# EAGLE design LED matrix (EAGLE 5.06)
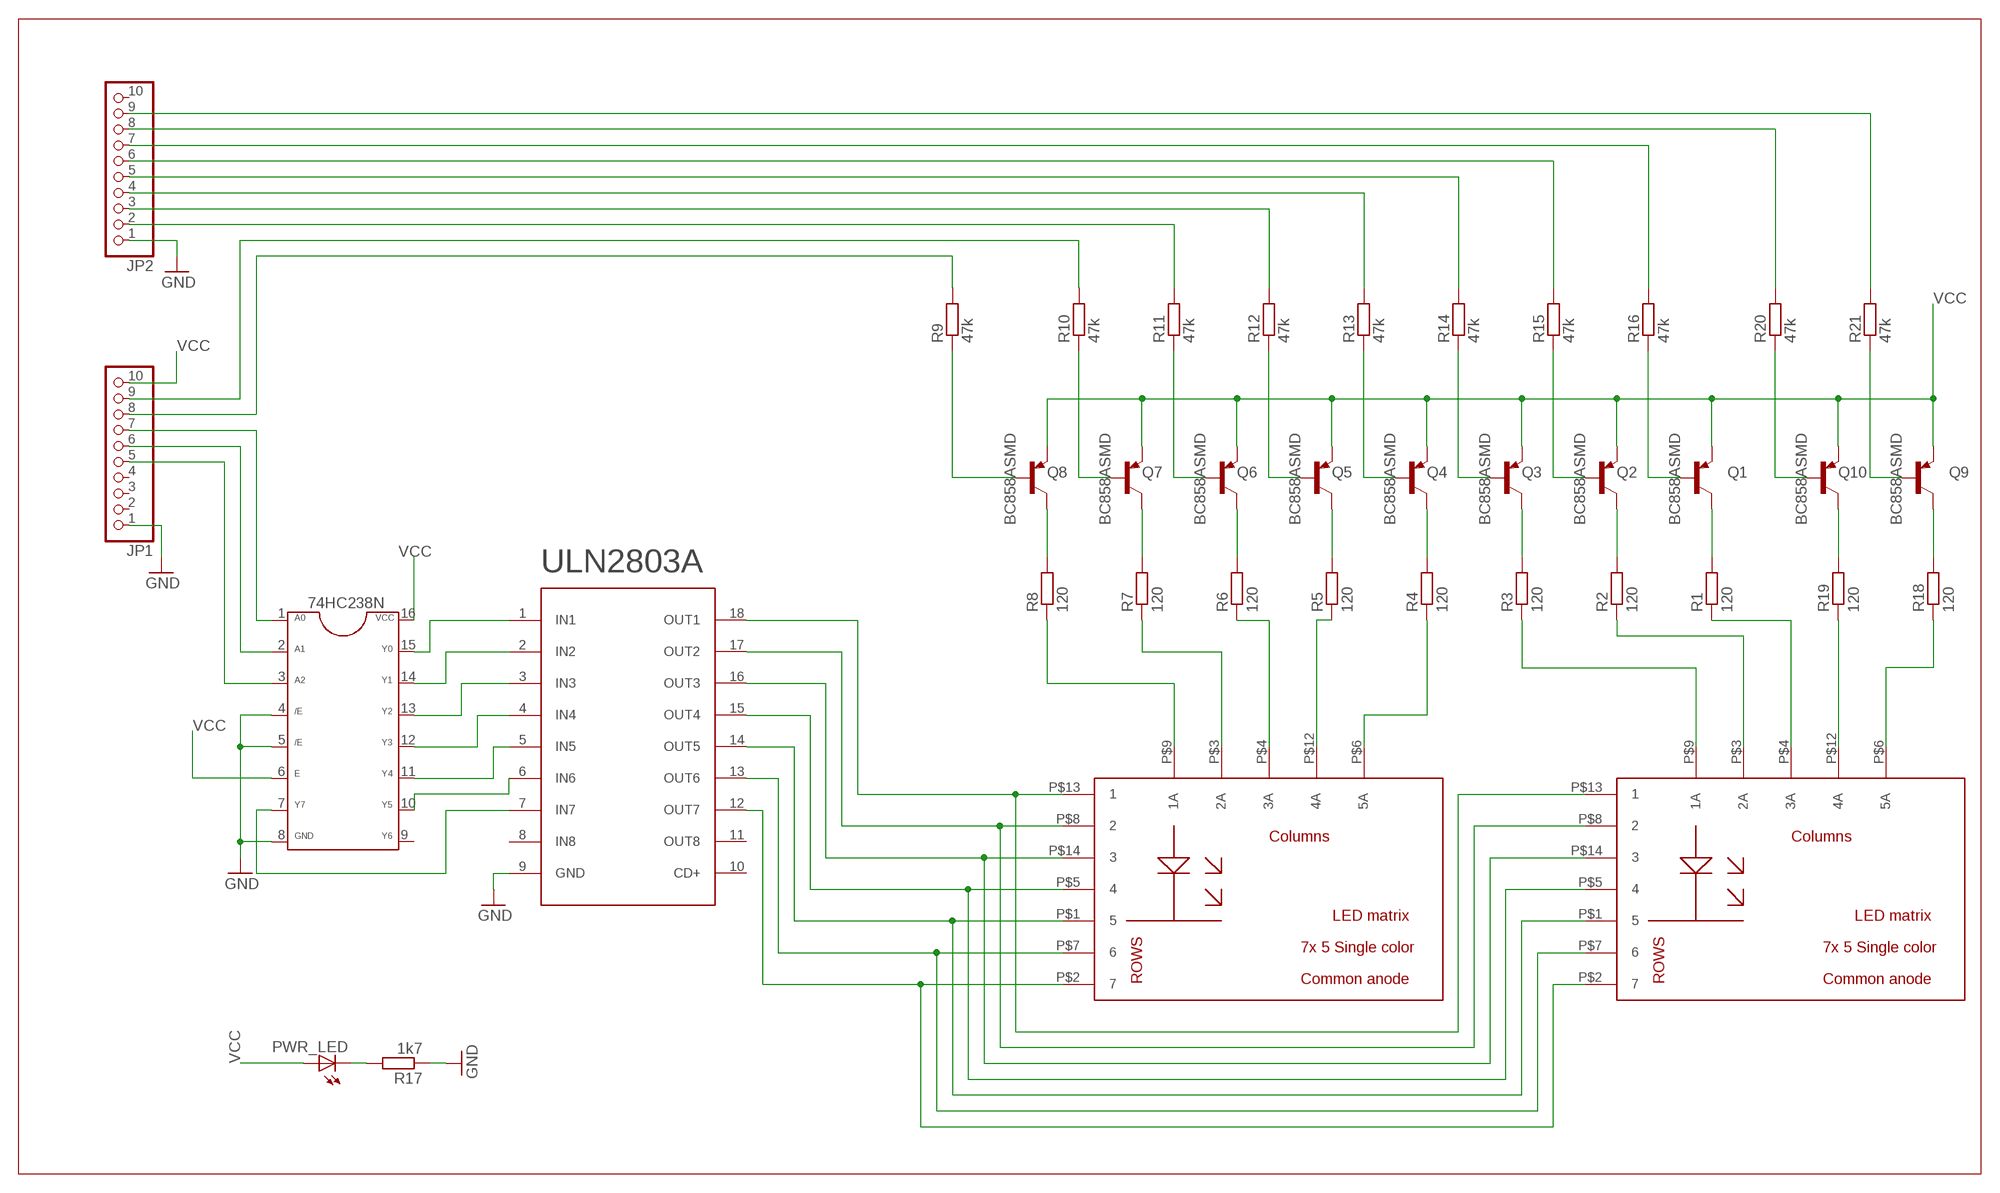
[diagram p0: schematic, sheet 1]

## Parts
74HC238N  DIL16  [DIL16]
JP1  PINHD-1X10_2.54-90°  [1X10/90]
JP2  PINHD-1X10_2.54-90°  [1X10/90]
PWR_LED  LED3MM  [LED3MM]
Q1  BC858ASMD  [SOT23-BEC]
Q2  BC858ASMD  [SOT23-BEC]
Q3  BC858ASMD  [SOT23-BEC]
Q4  BC858ASMD  [SOT23-BEC]
Q5  BC858ASMD  [SOT23-BEC]
Q6  BC858ASMD  [SOT23-BEC]
Q7  BC858ASMD  [SOT23-BEC]
Q8  BC858ASMD  [SOT23-BEC]
Q9  BC858ASMD  [SOT23-BEC]
Q10  BC858ASMD  [SOT23-BEC]
R1  120  R-EU_R1206  [R1206]
R2  120  R-EU_R1206  [R1206]
R3  120  R-EU_R1206  [R1206]
R4  120  R-EU_R1206  [R1206]
R5  120  R-EU_R1206  [R1206]
R6  120  R-EU_R1206  [R1206]
R7  120  R-EU_R1206  [R1206]
R8  120  R-EU_R1206  [R1206]
R9  47k  R-EU_R1206  [R1206]
R10  47k  R-EU_R1206  [R1206]
R11  47k  R-EU_R1206  [R1206]
R12  47k  R-EU_R1206  [R1206]
R13  47k  R-EU_R1206  [R1206]
R14  47k  R-EU_R1206  [R1206]
R15  47k  R-EU_R1206  [R1206]
R16  47k  R-EU_R1206  [R1206]
R17  1k7  R-EU_R1206  [R1206]
R18  120  R-EU_R1206  [R1206]
R19  120  R-EU_R1206  [R1206]
R20  47k  R-EU_R1206  [R1206]
R21  47k  R-EU_R1206  [R1206]
U$1  LED_MATRIX_7X5  [LED_MATRIX_8X8_SINGLE_COLOR]
U$2  LED_MATRIX_7X5  [LED_MATRIX_8X8_SINGLE_COLOR]
ULN2803A  ULN2803A  [DIL18]

## Nets
1: JP1.8 R9.2
2: JP1.9 R10.2
3: JP2.2 R11.2
4: JP2.3 R12.2
5: JP2.4 R13.2
6: JP2.5 R14.2
7: JP2.6 R15.2
8: JP2.7 R16.2
9: JP2.8 R20.2
10: JP2.9 R21.2
GND: 74HC238N.4 74HC238N.5 74HC238N.8 JP1.1 JP2.1 R17.1 ULN2803A.9(GND)
N$1: Q8.B R9.1
N$2: Q7.B R10.1
N$3: Q6.B R11.1
N$4: Q5.B R12.1
N$5: Q4.B R13.1
N$6: Q3.B R14.1
N$7: Q2.B R15.1
N$8: Q1.B R16.1
N$9: Q8.C R8.2
N$10: Q7.C R7.2
N$11: Q6.C R6.2
N$12: Q5.C R5.2
N$13: Q4.C R4.2
N$14: Q3.C R3.2
N$15: Q2.C R2.2
N$16: Q1.C R1.2
N$17: PWR_LED.K(C) R17.2
N$18: Q10.B R20.1
N$19: Q9.B R21.1
N$20: Q10.C R19.2
N$21: Q9.C R18.2
N$22: R18.1 U$2.P$6(5A)
N$23: R19.1 U$2.P$12(4A)
N$24: R1.1 U$2.P$4(3A)
N$25: U$1.P$5 U$2.P$5 ULN2803A.15(OUT4)
N$26: U$1.P$13 U$2.P$13 ULN2803A.18(OUT1)
N$27: R2.1 U$2.P$3(2A)
N$28: R3.1 U$2.P$9(1A)
N$29: U$1.P$14 U$2.P$14 ULN2803A.16(OUT3)
N$30: U$1.P$8 U$2.P$8 ULN2803A.17(OUT2)
N$31: R4.1 U$1.P$6(5A)
N$32: R5.1 U$1.P$12(4A)
N$33: R6.1 U$1.P$4(3A)
N$34: R7.1 U$1.P$3(2A)
N$35: R8.1 U$1.P$9(1A)
N$36: 74HC238N.1 JP1.7
N$37: 74HC238N.2 JP1.6
N$38: 74HC238N.3 JP1.5
N$39: 74HC238N.15 ULN2803A.1(IN1)
N$40: 74HC238N.14 ULN2803A.2(IN2)
N$41: U$1.P$1 U$2.P$1 ULN2803A.14(OUT5)
N$42: U$1.P$7 U$2.P$7 ULN2803A.13(OUT6)
N$43: U$1.P$2 U$2.P$2 ULN2803A.12(OUT7)
N$44: 74HC238N.13 ULN2803A.3(IN3)
N$45: 74HC238N.12 ULN2803A.4(IN4)
N$46: 74HC238N.11 ULN2803A.5(IN5)
N$47: 74HC238N.10 ULN2803A.6(IN6)
N$48: 74HC238N.7 ULN2803A.7(IN7)
VCC: 74HC238N.6 74HC238N.16 JP1.10 PWR_LED.A Q1.E Q2.E Q3.E Q4.E Q5.E Q6.E Q7.E Q8.E Q9.E Q10.E
Unconnected: 74HC238N.9 JP1.2 JP1.3 JP1.4 JP2.10 ULN2803A.8(IN8) ULN2803A.10(CD+) ULN2803A.11(OUT8)

## Library data of the parts
74HC238N = at90,:DIL16: Dual In Line / Socket
JP1 JP2 = acon-tyco (19):PINHD-1X10: PIN HEADER
PWR_LED = led:LED: LED OSRAM: - CHIPLED LG R971, LG N971, LY N971, LG Q971, LY Q971, LO R971, LY R971 LH N974, LH R974 LS Q976, LO Q976, LY Q976 LO Q996 - Hyper CHIPLED LW Q18S LB Q993, LB Q99A, LB R99A - SideLED LS A670, LO A670, LY A670, LG A670, LP A670 LB A673, LV A673, LT A673, LW A673 LH A674 LY A675 LS A676, LA A676, LO A676, LY A676, LW A676 LS A679, LY A679, LG A679 - Hyper Micro SIDELED® LS Y876, LA Y876, LO Y876, LY Y876 LT Y87S - SmartLED LW L88C, LW L88S LB L89C, LB L89S, LG L890 LS L89K, LO L89K, LY L89K LS L896, LA L896, LO L896, LY L896 - TOPLED LS T670, LO T670, LY T670, LG T670, LP T670 LSG T670, LSP T670, LSY T670, LOP T670, LYG T670 LG T671, LOG T671, LSG T671 LB T673, LV T673, LT T673, LW T673 LH T674 LS T676, LA T676, LO T676, LY T676, LB T676, LH T676, LSB T676, LW T676 LB T67C, LV T67C, LT T67C, LS T67K, LO T67K, LY T67K, LW E67C LS E67B, LA E67B, LO E67B, LY E67B, LB E67C, LV E67C, LT E67C LW T67C LS T679, LY T679, LG T679 LS T770, LO T770, LY T770, LG T770, LP T770 LB T773, LV T773, LT T773, LW T773 LH T774 LS E675, LA E675, LY E675, LS T675 LS T776, LA T776, LO T776, LY T776, LB T776 LHGB T686 LT T68C, LB T68C - Hyper Mini TOPLED® LB M676 - Mini TOPLED Santana® LG M470 LS M47K, LO M47K, LY M47K Source: http://www.osram.convergy.de LUXEON: - LUMILED® LXK2-PW12-R00, LXK2-PW12-S00, LXK2-PW14-U00, LXK2-PW14-V00 LXK2-PM12-R00, LXK2-PM12-S00, LXK2-PM14-U00 LXK2-PE12-Q00, LXK2-PE12-R00, LXK2-PE12-S00, LXK2-PE14-T00, LXK2-PE14-U00 LXK2-PB12-K00, LXK2-PB12-L00, LXK2-PB12-M00, LXK2-PB14-N00, LXK2-PB14-P00, LXK2-PB14-Q00 LXK2-PR12-L00, LXK2-PR12-M00, LXK2-PR14-Q00, LXK2-PR14-R00 LXK2-PD12-Q00, LXK2-PD12-R00, LXK2-PD12-S00 LXK2-PH12-R00, LXK2-PH12-S00 LXK2-PL12-P00, LXK2-PL12-Q00, LXK2-PL12-R00 Source: www.luxeon.com KINGBRIGHT: KA-3528ASYC Source: www.kingbright.com
Q1-Q10 = transistor-pnp:BC858*: PNP Transistror
R1-R21 = resistor:R-EU_: RESISTOR, European symbol
U$1 U$2 = at90,:LED_MATRIX_7X5
ULN2803A = UNdarlingtony:ULN2803A

## Board
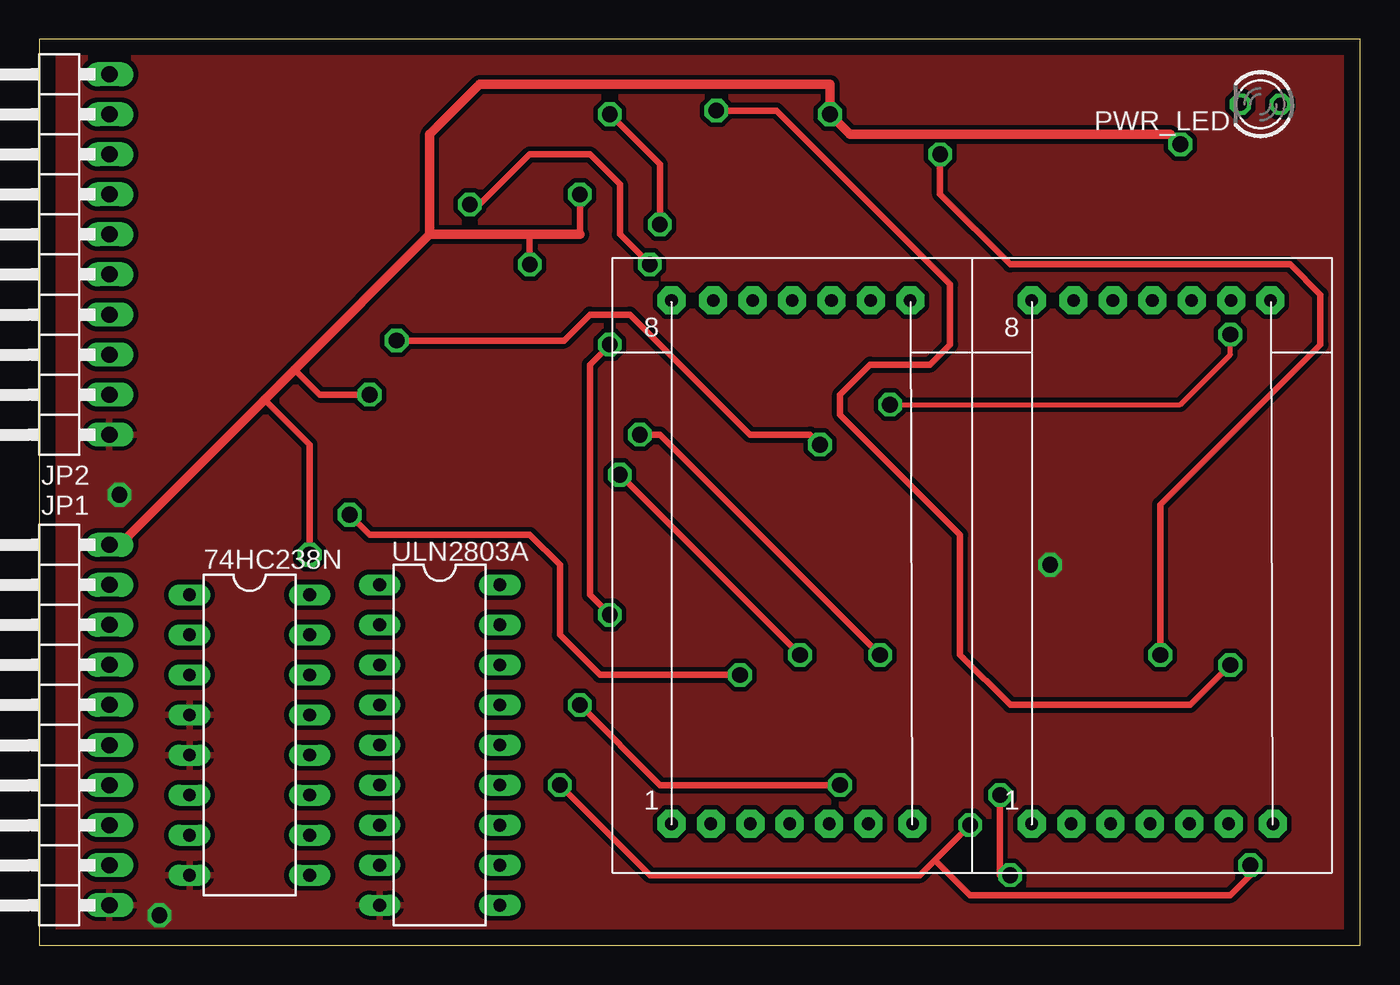
[diagram p1: board, top side]
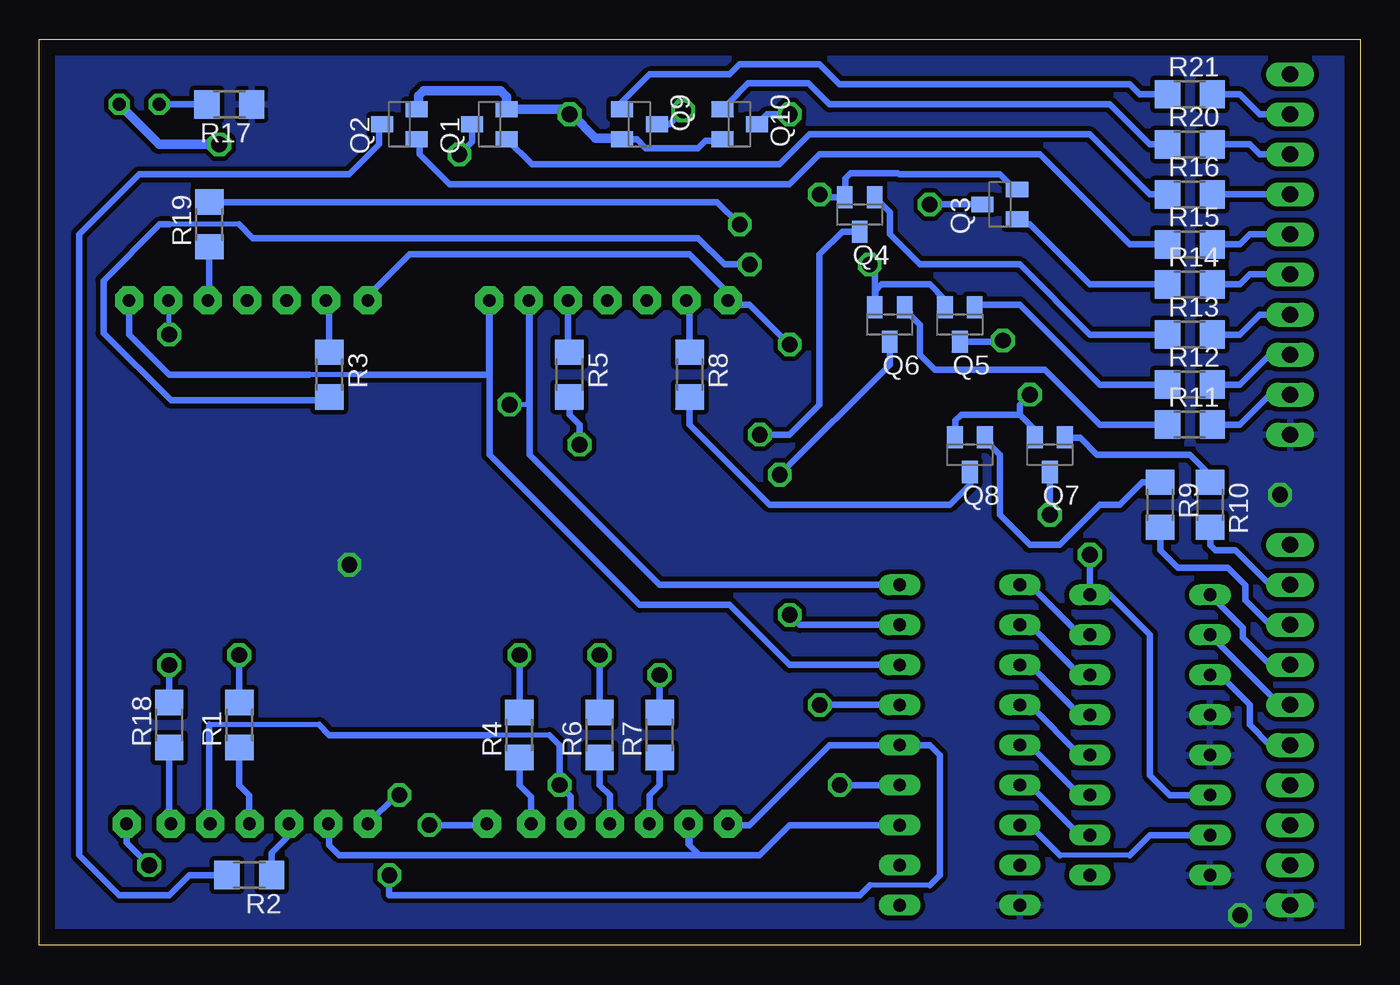
[diagram p2: board, bottom side, seen from below]

Size 83.8 x 57.45 mm. Coordinates in mm from the lower left corner, seen from the top.
Outline: 0,0 83.8,0 83.8,57.45 0,57.45 0,0
Copper layers (1*16): Top 0.035mm / dielectric 1.5mm / Bottom 0.035mm
Design rules "default *": minimum track width 10mil, minimum drill 24mil, track to track 8mil, track to pad 8mil, pad to pad 8mil, via to via 8mil, smd to smd 8mil, copper to edge 40mil, drill to drill 8mil, minimum pad ring 10mil, minimum via ring 8mil, stop-mask expansion 4mil, vias tented up to drill 0mil, thermal gap 10mil

### Footprints (pad centres in the part's own frame; a part is rotated, then mirrored left to right if it is on the bottom)
DIL16 = drill 0.813 long: 1 -8.89,-3.81; 2 -6.35,-3.81; 3 -3.81,-3.81; 4 -1.27,-3.81; 5 1.27,-3.81; 6 3.81,-3.81; 7 6.35,-3.81; 8 8.89,-3.81; 9 8.89,3.81; 10 6.35,3.81; 11 3.81,3.81; 12 1.27,3.81; 13 -1.27,3.81; 14 -3.81,3.81; 15 -6.35,3.81; 16 -8.89,3.81
1X10/90 = drill 1.016 long: 1 -11.43,-3.81; 2 -8.89,-3.81; 3 -6.35,-3.81; 4 -3.81,-3.81; 5 -1.27,-3.81; 6 1.27,-3.81; 7 3.81,-3.81; 8 6.35,-3.81; 9 8.89,-3.81; 10 11.43,-3.81
LED3MM = drill 0.813 octagon: A -1.27,0; K 1.27,0
SOT23-BEC = smd 1 x 1.4: B -0.95,-1.1; C 0,1.1; E 0.95,-1.1
R1206 = smd 1.6 x 1.803: 1 -1.422,0; 2 1.422,0
LED_MATRIX_8X8_SINGLE_COLOR = drill 0.8 pad 1.778 octagon: P$1 -6.25,-6.9; P$2 -3.75,-6.9; P$3 -1.25,-6.9; P$4 1.25,-6.9; P$5 3.75,-6.9; P$6 6.25,-6.9; P$7 9.05,-6.9; P$8 -6.25,26.3; P$9 -3.6,26.3; P$10 -1.1,26.3; P$11 1.4,26.3; P$12 3.9,26.3; P$13 6.4,26.3; P$14 8.9,26.3
DIL18 = drill 0.813 long: 1 -10.16,-3.81; 2 -7.62,-3.81; 3 -5.08,-3.81; 4 -2.54,-3.81; 5 0,-3.81; 6 2.54,-3.81; 7 5.08,-3.81; 8 7.62,-3.81; 9 10.16,-3.81; 10 10.16,3.81; 11 7.62,3.81; 12 5.08,3.81; 13 2.54,3.81; 14 0,3.81; 15 -2.54,3.81; 16 -5.08,3.81; 17 -7.62,3.81; 18 -10.16,3.81

### Placement (x,y rotation side)
74HC238N  13.34,13.34 270 top
JP1  0.64,13.97 90 top
JP2  0.64,43.81 90 top
PWR_LED  77.47,53.34 180 top
Q1  55.24,52.07 90 bottom
Q2  60.96,52.07 90 bottom
Q3  22.86,46.99 90 bottom
Q4  31.75,46.35 180 bottom
Q5  25.4,39.37 180 bottom
Q6  29.84,39.37 180 bottom
Q7  19.68,31.11 180 bottom
Q8  24.77,31.11 180 bottom
Q9  45.72,52.07 270 bottom
Q10  39.37,52.07 270 bottom
R1  71.12,13.97 90 bottom
R2  70.48,4.45 180 bottom
R3  65.41,36.2 270 bottom
R4  53.34,13.34 90 bottom
R5  50.16,36.2 270 bottom
R6  48.26,13.34 90 bottom
R7  44.45,13.34 90 bottom
R8  42.55,36.2 270 bottom
R9  12.7,27.94 270 bottom
R10  9.53,27.94 270 bottom
R11  10.79,33.02 0 bottom
R12  10.79,35.56 0 bottom
R13  10.79,38.73 0 bottom
R14  10.79,41.91 0 bottom
R15  10.79,44.45 0 bottom
R16  10.79,47.62 0 bottom
R17  71.75,53.34 180 bottom
R18  75.56,13.97 90 bottom
R19  73.03,45.72 90 bottom
R20  10.79,50.8 0 bottom
R21  10.79,53.98 0 bottom
U$1  46.35,14.61 0 top
U$2  69.22,14.61 0 top
ULN2803A  25.4,12.7 270 top

### Tracks (layer width: path | path; a pad name or v marks a point on that pad's centre or on a via)
1
  Bottom 0.406: JP1.8 5.71,20.32 6.99,21.59 7.01,21.59 7.29,21.87 7.29,22.82 8.4,23.93 11.57,23.93 12.68,25.04 12.68,26.5 R9.2
2
  Bottom 0.406: JP1.9 5.74,22.86 7.92,25.04 9.19,25.04 9.51,25.36 9.51,26.5 R10.2
3
  Bottom 0.406: JP2.2 5.71,34.92 7.62,33.02 R11.2
4
  Bottom 0.406: JP2.3 5.71,37.47 7.62,35.56 R12.2
5
  Bottom 0.406: JP2.4 6.35,40.01 7.62,38.73 R13.2
6
  Bottom 0.406: JP2.5 6.99,42.55 7.62,41.91 R14.2
7
  Bottom 0.406: JP2.6 6.99,45.09 7.62,44.45 R15.2
8
  Bottom 0.406: JP2.7 R16.2
9
  Bottom 0.406: JP2.8 6.35,50.16 6.99,50.8 R20.2
10
  Bottom 0.406: JP2.9 6.35,52.7 7.62,53.98 R21.2
GND  (via drill 1)
  other vias: 7.62,1.91 5.08,28.57 64.14,24.13
  pour Bottom (isolate 0.305): -8.89,-5.08 90.17,-5.08 90.17,63.5 -8.89,63.5
  pour Top (isolate 0.305): -6.35,-2.54 87,-2.54 87,60.96 -6.35,60.96
N$1
  Bottom 0.406: Q8.B 23.46,31.86 23.46,31.7 22.86,31.1 22.86,27.3 20.95,25.4 19.05,25.4 16.51,27.94 15.24,27.94 13.82,29.36 R9.1
N$2
  Bottom 0.406: R10.1 9.53,29.84 10.79,31.11 16.69,31.11 17.75,32.17 18.7,32.17 Q7.B
N$3
  Bottom 0.406: R11.1 16.51,33.02 20,36.51 26.99,36.51 27.94,37.47 27.94,39.37 28.57,40.01 28.57,40.15 Q6.B
N$4
  Bottom 0.406: R12.1 16.51,35.56 21.59,40.64 24.28,40.64 Q5.B
N$5
  Bottom 0.406: R13.1 17.14,38.73 21.59,43.18 27.94,43.18 29.84,45.09 29.84,46.5 Q4.B
N$6
  Bottom 0.406: R14.1 17.14,41.91 20.95,45.72 21.44,45.72 Q3.B
N$7
  Bottom 0.406: R15.1 14.61,44.45 20.32,50.16 34.29,50.16 36.2,48.26 57.78,48.26 59.69,50.16 59.69,50.95 Q2.B
N$8
  Bottom 0.406: R16.1 13.34,47.62 17.14,51.44 34.92,51.44 36.83,49.53 52.55,49.53 Q1.B
N$9
  Bottom 0.406: Q8.C 24.77,29.21 26.04,27.94 37.47,27.94 42.55,33.02 R8.2
N$10  (via drill 1)
  Top 0.406: v19.68,27.3 20.95,26.04 31.11,26.04 33.02,24.13 33.02,19.68 35.56,17.14 v44.45,17.14
  Bottom 0.406: v19.68,27.3 Q7.C | v44.45,17.14 R7.2
N$11  (via drill 1)
  Top 0.406: v48.26,18.41 v36.83,29.84
  Bottom 0.406: Q6.C 29.84,36.83 v36.83,29.84 | R6.2 v48.26,18.41
N$12  (via drill 1)
  Top 0.406: v22.67,38.36 33.28,38.36 34.92,40.01 37.47,40.01 45.09,32.38 48.9,32.38 v49.53,31.75
  Bottom 0.406: Q5.C 22.75,38.27 v22.67,38.36 | v49.53,31.75 49.53,33.02 50.16,33.66 R5.2
N$13  (via drill 1)
  Top 0.406: v38.1,32.38 39.37,32.38 v53.34,18.41
  Bottom 0.406: Q4.C 32.85,45.26 34.29,43.81 34.29,34.29 36.2,32.38 v38.1,32.38 | R4.2 v53.34,18.41
N$14  (via drill 1)
  Top 0.406: v27.3,46.99 27.94,46.99 31.11,50.16 34.92,50.16 36.83,48.26 36.83,45.09 v38.73,43.18
  Bottom 0.305: 71.12,45.72 75.56,45.72
  Bottom 0.406: Q3.C v27.3,46.99 | v38.73,43.18 40.33,43.18 42,44.85 70.25,44.85 71.12,45.72 | 75.56,45.72 76.17,45.72 79.72,42.16 79.72,38.83 75.45,34.55 65.62,34.55 R3.2
N$15
  Bottom 0.406: Q2.C 62.23,51.9 62.23,50.8 64.14,48.9 77.47,48.9 81.28,45.09 81.28,5.71 78.74,3.17 75.56,3.17 74.3,4.45 R2.2
N$16  (via drill 1)
  Top 0.406: v57.15,50.16 57.15,47.62 61.59,43.18 79.38,43.18 81.28,41.27 81.28,38.1 71.12,27.94 v71.12,18.41
  Bottom 0.406: Q1.C 56.34,50.97 v57.15,50.16 | R1.2 v71.12,18.41
N$17
  Bottom 0.406: R17.2 PWR_LED.K
N$18
  Bottom 0.406: R20.1 13.34,50.8 15.88,53.34 33.66,53.34 35,54.68 38.83,54.68 39.52,54 39.52,53.98 Q10.B
N$19
  Bottom 0.406: R21.1 13.97,53.98 14.61,54.61 33.02,54.61 34.29,55.88 39.37,55.88 40.01,55.24 45.09,55.24 46.99,53.34 46.99,53.19 Q9.B
N$20  (via drill 1)
  Top 0.406: v39.37,45.72 39.37,49.53 v36.2,52.7
  Bottom 0.406: v36.2,52.7 37.63,52.7 Q10.C | R19.2 40.79,47.14 v39.37,45.72
N$21  (via drill 1)
  Top 0.406: v42.95,52.94 46.76,52.94 57.78,41.91 57.78,38.1 56.52,36.83 52.7,36.83 50.8,34.92 50.8,33.66 58.42,26.04 58.42,18.41 61.59,15.24 73.03,15.24 v75.56,17.78
  Bottom 0.406: Q9.C 43.81,52.07 43.18,52.7 43.18,52.71 v42.95,52.94 | v75.56,17.78 R18.2
N$22
  Bottom 0.406: R18.1 75.56,7.8 U$2.P$6
N$23
  Bottom 0.406: R19.1 73.03,40.99 U$2.P$12
N$24
  Bottom 0.406: R1.1 71.12,10.16 70.48,9.53 70.48,7.72 U$2.P$4
N$25  (via drill 1)
  Top 0.406: v50.8,10.16 39.37,10.16 v34.29,15.24
  Bottom 0.305: 51.44,13.34 55.24,13.34 | 66.04,13.97 73.03,13.97
  Bottom 0.406: U$1.P$5 50.1,9.46 v50.8,10.16 50.8,12.7 51.44,13.34 | ULN2803A.15 v34.29,15.24 | 55.24,13.34 65.41,13.34 66.04,13.97 | 73.03,13.97 73.03,7.76 U$2.P$5
N$26  (via drill 1)
  Top 0.305: v53.98,34.29 72.39,34.29 75.56,37.47 v75.56,38.73
  Bottom 0.305: v75.56,38.73 75.56,40.85 U$2.P$13 | U$1.P$13 52.76,34.34 52.7,34.29 v53.98,34.29
  Bottom 0.406: ULN2803A.18 44.45,22.86 52.7,31.11 52.7,34.29 52.7,40.85 U$1.P$13
N$27
  Bottom 0.406: 67.94,7.72 U$2.P$3 67.94,7.68 67.94,6.99 69.06,5.87 R2.1
N$28
  Bottom 0.406: R3.1 65.41,40.7 U$2.P$9
N$29
  Bottom 0.305: 63.5,36.2 66.67,36.2
  Bottom 0.406: ULN2803A.16 36.2,17.78 40.01,21.59 45.72,21.59 55.24,31.11 55.24,36.2 | 55.24,36.2 55.24,40.9 U$1.P$14 55.26,36.2 55.24,36.2 | 55.24,36.2 63.5,36.2 | 66.67,36.2 75.56,36.2 78.11,38.73 78.11,40.9 U$2.P$14
N$30  (via drill 1)
  Top 0.406: v36.2,38.1 34.92,36.83 34.92,22.23 v36.2,20.95
  Bottom 0.406: ULN2803A.17 35.56,20.32 v36.2,20.95 | v36.2,38.1 38.73,40.64 39.84,40.64 U$1.P$8 40.1,41.38 42.55,43.81 60.33,43.81 62.87,41.27 62.87,41.01 U$2.P$8
N$31
  Bottom 0.406: U$1.P$6 52.6,9.43 53.34,10.16 R4.1
N$32
  Bottom 0.406: U$1.P$12 50.26,37.71 R5.1
N$33
  Bottom 0.406: U$1.P$4 47.6,9.51 48.26,10.16 R6.1
N$34
  Bottom 0.406: R7.1 44.45,10.16 45.09,9.53 45.09,7.72 U$1.P$3
N$35
  Bottom 0.406: R8.1 42.55,40.7 U$1.P$9
N$36
  Bottom 0.406: JP1.7 5.71,17.78 6.99,19.05 7,19.05 7.45,19.5 7.45,20.13 8.56,21.24 8.56,21.26 74HC238N.1
N$37
  Bottom 0.406: JP1.6 5.08,15.24 74HC238N.2
N$38
  Bottom 0.406: JP1.5 5.71,12.7 6.99,13.97 6.99,15.24 8.89,17.14 74HC238N.3
N$39
  Bottom 0.406: 74HC238N.15 17.78,19.68 20.95,22.86 ULN2803A.1
N$40
  Bottom 0.406: 74HC238N.14 17.78,17.14 20.95,20.32 ULN2803A.2
N$41  (via drill 1)
  Top 0.406: v61.59,4.45 60.96,4.45 v60.96,9.53
  Bottom 0.305: 27.3,3.81 31.11,3.81
  Bottom 0.406: U$1.P$1 40.02,7.62 38.73,7.62 33.66,12.7 ULN2803A.14 27.3,12.7 26.67,12.06 26.67,4.45 27.3,3.81 | 31.11,3.81 31.75,3.17 61.59,3.17 v61.59,4.45 | v60.96,9.53 61.15,9.53 U$2.P$1
N$42  (via drill 1)
  Top 0.406: v33.02,10.16 38.73,4.45 55.88,4.45 56.83,5.4 | 56.83,5.4 v59.05,7.62 | 56.83,5.4 59.05,3.17 75.56,3.17 76.83,4.45 v76.83,5.08
  Bottom 0.406: ULN2803A.13 v33.02,10.16 | v59.05,7.62 55.49,7.62 U$1.P$7 | U$2.P$7 78.27,6.51 v76.83,5.08
N$43
  Bottom 0.406: ULN2803A.12 36.2,7.62 38.1,5.71 41.91,5.71 | 41.91,5.71 42.55,6.35 42.55,7.64 U$1.P$2 42.6,6.41 41.91,5.71 | 41.91,5.71 64.77,5.71 65.41,6.35 65.41,7.64 U$2.P$2
N$44
  Bottom 0.406: 74HC238N.13 17.78,14.61 20.95,17.78 ULN2803A.3
N$45
  Bottom 0.406: 74HC238N.12 17.78,12.06 20.95,15.24 ULN2803A.4
N$46
  Bottom 0.406: 74HC238N.11 17.78,9.53 20.95,12.7 ULN2803A.5
N$47
  Bottom 0.406: 74HC238N.10 17.78,6.99 20.95,10.16 ULN2803A.6
N$48
  Bottom 0.305: 14.61,5.71 19.05,5.71
  Bottom 0.406: 74HC238N.7 13.34,6.99 14.61,5.71 | 19.05,5.71 20.95,7.62 ULN2803A.7
VCC  (via drill 1)
  Top 0.406: v17.14,24.77 17.14,31.75 14.29,34.61 | 34.29,45.09 v34.29,47.62 | 31.11,45.09 v31.11,43.18 | v20.95,34.92 17.78,34.92 16.19,36.51
  Top 0.61: JP1.10 5.08,25.4 14.29,34.61 16.19,36.51 24.77,45.09 | v72.39,50.8 71.75,51.44 51.44,51.44 v50.16,52.7 50.16,54.61 27.94,54.61 24.77,51.44 24.77,45.09 | 34.29,45.09 31.11,45.09 24.77,45.09
  Bottom 0.406: 74HC238N.6 12.06,9.53 13.34,10.79 13.34,19.68 15.88,22.23 74HC238N.16 v17.14,24.77 | 21.59,33.66 25.31,33.66 25.68,33.28 25.68,32.25 Q8.E | Q5.E 26.35,40.95 27.3,41.91 30.37,41.91 30.75,41.53 30.75,40.52 Q6.E 30.8,42.86 v31.11,43.18 | Q9.E 45.89,51.12 45.33,50.56 42,50.56 41.53,51.04 40.55,51.04 Q10.E | v34.29,47.62 34.12,47.45 Q4.E 32.65,47.5 32.65,48.66 32.33,48.98 29.32,48.98 29.24,48.9 22.86,48.9 21.91,47.94 Q3.E | Q7.E 20.64,32.7 21.59,33.66 | 21.59,33.66 21.59,34.29 v20.95,34.92
  Bottom 0.61: v72.39,50.8 76.2,50.8 PWR_LED.A | Q9.E 46.9,51.2 48.5,51.2 50.01,52.7 v50.16,52.7 50.48,53.02 Q1.E 54.15,53.83 54.52,54.21 59.44,54.21 59.76,53.89 59.76,53.13 Q2.E